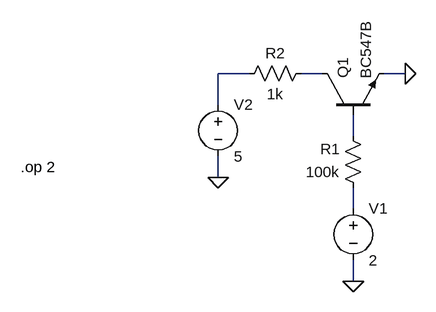
[diagram p0: schematic BC547B_Test.asc]
BC547B_Test.asc, the LTspice schematic file:
Version 4
SHEET 1 880 680
WIRE 0 112 -48 112
WIRE 112 112 80 112
WIRE 240 112 208 112
WIRE -48 160 -48 112
WIRE 160 208 160 176
WIRE -48 272 -48 240
WIRE 160 320 160 288
WIRE 160 432 160 400
FLAG -48 272 0
FLAG 160 432 0
FLAG 240 112 0
SYMBOL npn 112 176 R270
SYMATTR InstName Q1
SYMATTR Value BC547B
SYMBOL res 176 304 R180
WINDOW 0 36 76 Left 2
WINDOW 3 36 40 Left 2
SYMATTR InstName R1
SYMATTR Value 100k
SYMBOL voltage 160 304 R0
WINDOW 123 0 0 Left 0
WINDOW 39 0 0 Left 0
SYMATTR InstName V1
SYMATTR Value 2
SYMBOL voltage -48 144 R0
WINDOW 123 0 0 Left 0
WINDOW 39 0 0 Left 0
SYMATTR InstName V2
SYMATTR Value 5
SYMBOL res -16 128 R270
WINDOW 0 32 56 VTop 2
WINDOW 3 0 56 VBottom 2
SYMATTR InstName R2
SYMATTR Value 1k
TEXT -352 256 Left 2 !.op 2

The netlist it stands for:
* BC547B_Test.asc
Q1 N002 N003 0 0 BC547B
R1 N004 N003 100k
V1 N004 0 2
V2 N001 0 5
R2 N001 N002 1k
.model NPN NPN
.model PNP PNP
.lib standard.bjt
.op 2
.backanno
.end